# Altium schematic sheet [5]-CONNECTORS.SchDoc
size A4
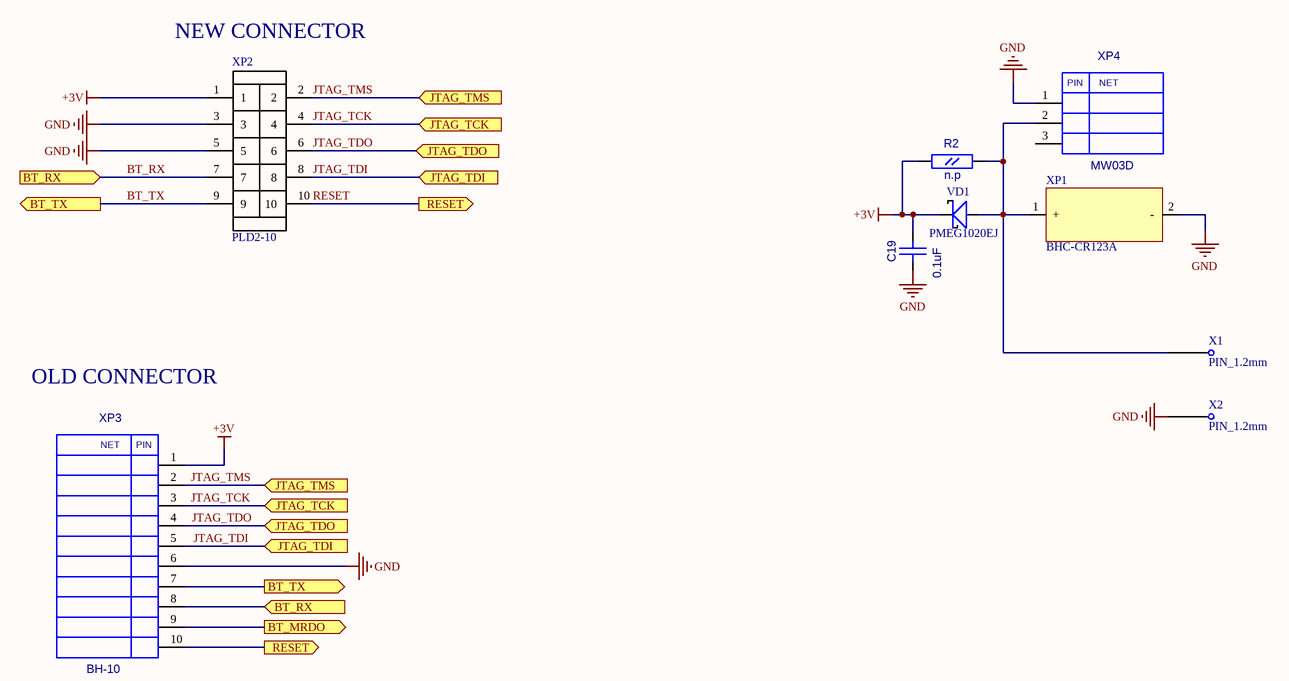
[diagram p0: [5]-CONNECTORS.SchDoc]

## Parts
C19  0.1uF  [CC0603]
R2  n.p  [RC0603]
VD1  PMEG1020EJ  [SOD323]
X1  PIN_1.2mm  [PIN_1.2mm]
X2  PIN_1.2mm  [PIN_1.2mm]
XP1  BHC-CR123A  [CR123_HOLDER]
XP2  PLD2-10  [PLD2-10]
XP3  BH-10  [BH-10]
XP4  MW03D  [MW03D]

## Ports
BT_MRDO (out), BT_RX (in), BT_TX (out), JTAG_TCK (in), JTAG_TDI (in), JTAG_TDO (in), JTAG_TMS (in), RESET (out)

## Nets
+3V: C19.2(B) R2.1(A) VD1.2(K) XP2.1 XP3.1
GND: C19.1(A) X2.1 XP1.2(-) XP2.3 XP2.5 XP3.6 XP4.1
BT_MRDO: XP3.9 ; port BT_MRDO
BT_RX: XP2.7 XP3.8 ; port BT_RX
BT_TX: XP2.9 XP3.7 ; port BT_TX
JTAG_TCK: XP2.4 XP3.3 ; port JTAG_TCK
JTAG_TDI: XP2.8 XP3.5 ; port JTAG_TDI
JTAG_TDO: XP2.6 XP3.4 ; port JTAG_TDO
JTAG_TMS: XP2.2 XP3.2 ; port JTAG_TMS
RESET: XP2.10 XP3.10 ; port RESET
NetR2_2: R2.2(B) VD1.1(A) X1.1 XP1.1(+) XP4.2

Not connected (* = marked no-connect by the designer): XP4 3

## Notes on the sheet
- (near XP2) NEW CONNECTOR
- OLD CONNECTOR
- (in symbol BH-10) NET; PIN
- (in symbol MW03D) PIN; NET

## Library data of the parts
C19 = CC0603: Value: 0.1uF
R2 = RC0603: Value: n.p
VD1 = PMEG2010: Value: PMEG1020EJ
XP1 = BHC-CR123A: Holder for CR123 battery; Value: BHC-CR123A
XP2 = PLD2-10: Value: PLD2-10
XP3 = BH-10: Value: *
XP4 = MW03D: Value: *